# Altium schematic sheet AnalogOutput.SchDoc: Analog Output
size A4; Author: João Guimarães; Revision: 2.0; SheetNumber: 8; SheetTotal: 9
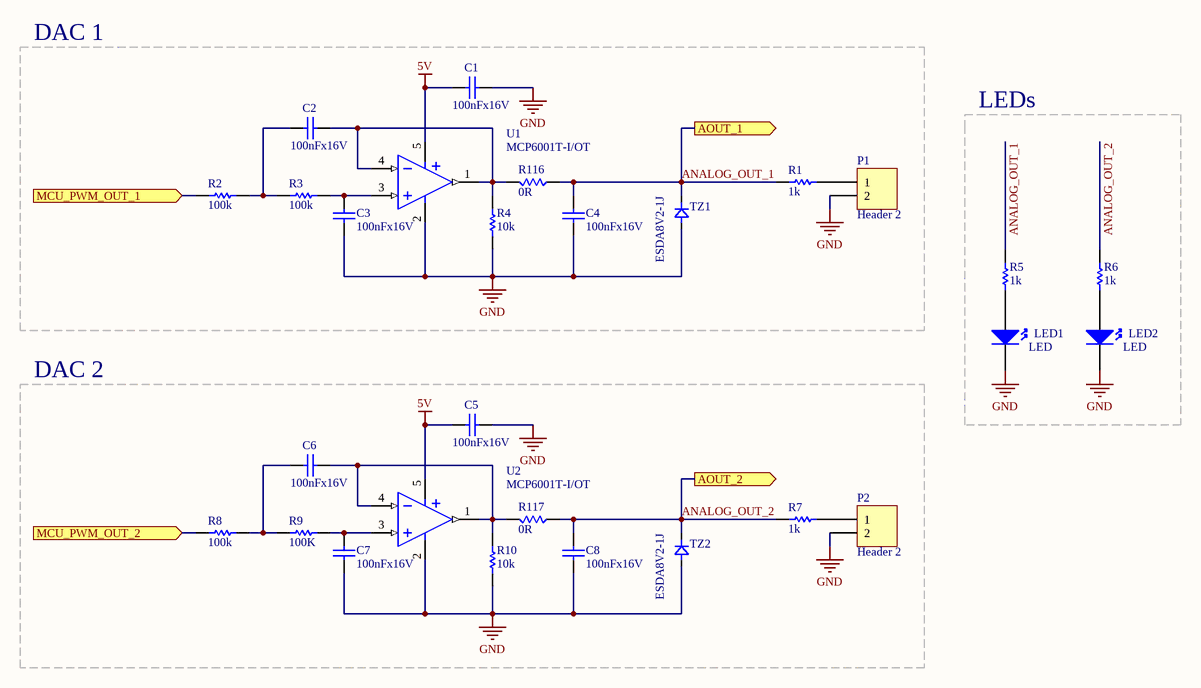
[diagram p0: AnalogOutput.SchDoc]

## Parts
C1  100nFx16V  [DISC-0805]
C2  100nFx16V  [DISC-0805]
C3  100nFx16V  [DISC-0805]
C4  100nFx16V  [DISC-0805]
C5  100nFx16V  [DISC-0805]
C6  100nFx16V  [DISC-0805]
C7  100nFx16V  [DISC-0805]
C8  100nFx16V  [DISC-0805]
LED1  LED  [DISC-LED-0.1-PTH]
LED2  LED  [DISC-LED-0.1-PTH]
P1  Header 2  [CON-FLEXWIRE-0.5MM2-1X2]
P2  Header 2  [CON-FLEXWIRE-0.5MM2-1X2]
R1  1k  [DISC-0805]
R2  100k  [DISC-0805]
R3  100k  [DISC-0805]
R4  10k  [DISC-0805]
R5  1k  [DISC-0805]
R6  1k  [DISC-0805]
R7  1k  [DISC-0805]
R8  100k  [DISC-0805]
R9  100K  [DISC-0805]
R10  10k  [DISC-0805]
R116  0R  [DISC-0805]
R117  0R  [DISC-0805]
TZ1  ESDA8V2-1J  [DISC-SOD-323]
TZ2  ESDA8V2-1J  [DISC-SOD-323]
U1  MCP6001T-I/OT  [CI-SOT-23-5]
U2  MCP6001T-I/OT  [CI-SOT-23-5]

## Blocks framed on the sheet
DAC 1: C1-C4 P1 R1-R4 R116 TZ1 U1
LEDs: LED1 LED2 R5 R6
DAC 2: C5-C8 P2 R7-R10 R117 TZ2 U2

## Ports
AOUT_1 (out), AOUT_2 (out), MCU_PWM_OUT_1 (in), MCU_PWM_OUT_2 (in)

## Nets
5V: C1.2 C5.2 U1.5(V+) U2.5(V+)
GND: C1.1 C3.2 C4.2 C5.1 C7.2 C8.2 LED1.2(K) LED2.2(K) P1.2 P2.2 R4.2 R10.2 TZ1.1(A) TZ2.1(A) U1.2(V-) U2.2(V-)
ANALOG_OUT_1: C4.1 R1.2 R5.2 R116.1 TZ1.2(C) ; port AOUT_1
ANALOG_OUT_2: C8.1 R6.2 R7.2 R117.1 TZ2.2(C) ; port AOUT_2
MCU_PWM_OUT_1: R2.2 ; port MCU_PWM_OUT_1
MCU_PWM_OUT_2: R8.2 ; port MCU_PWM_OUT_2
NetC2_1: C2.1 R4.1 R116.2 U1.1(Out) U1.4(IN-)
NetC2_2: C2.2 R2.1 R3.2
NetC3_1: C3.1 R3.1 U1.3(IN+)
NetC6_1: C6.1 R10.1 R117.2 U2.1(Out) U2.4(IN-)
NetC6_2: C6.2 R8.1 R9.2
NetC7_1: C7.1 R9.1 U2.3(IN+)
NetLED1_1: LED1.1(A) R5.1
NetLED2_1: LED2.1(A) R6.1
NetP1_1: P1.1 R1.1
NetP2_1: P2.1 R7.1

## Notes on the sheet
- Title:
- Project:
- Date:
- Author:
- Version:
- Sheet:
- of

## Library data of the parts
C1-C8 = Cap: Capacitor
P1 P2 = Header 2: Header, 2-Pin; LatestRevisionDate: 17-Jul-2002; LatestRevisionNote: Re-released for DXP Platform.; Publisher: Altium Limited
R1-R10 = Res: Resistor
R116 R117 = RESISTOR: PartNumber1: *; Manufacturer1: *; ClassName: *; Price: *; PriceType: FOB
TZ1 TZ2 = TVZ-Unidirectional
U1 U2 = MCP6001T-I/OT: Operational Amplifiers - Op Amps Single 1.8V 1MHz